# Altium schematic sheet Sensing - Temperature.SchDoc: [13] Sensing - Temperature
size A4; ApprovedBy: Nagy Richard; CheckedBy: Nagy Richard; Author: Nagy Richard; CompanyName: EmbedCore; DrawnBy: Nagy Richard; Engineer: Nagy Richard; Organization: EmbedCore; DocumentNumber: 13; Revision: 1.0; SheetNumber: 13; SheetTotal: 25
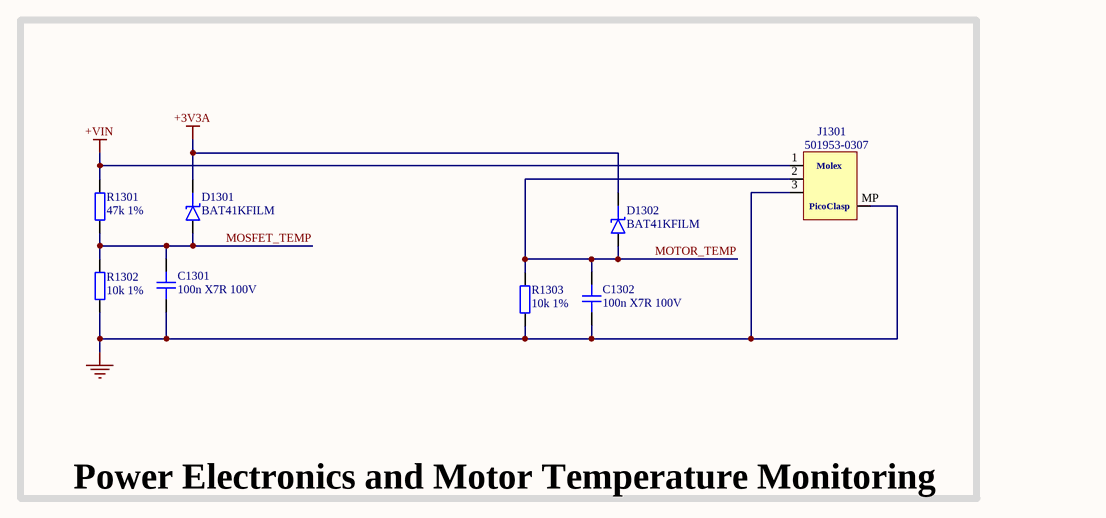
[diagram p0: Sensing - Temperature.SchDoc]

## Parts
C1301  100n X7R 100V  [CAP_0603]
C1302  100n X7R 100V  [CAP_0603]
D1301  BAT41KFILM  [SOD-523]
D1302  BAT41KFILM  [SOD-523]
J1301  501953-0307  [5019530307]
R1301  47k 1%  [RES_0603]
R1302  10k 1%  [RES_0603]
R1303  10k 1%  [RES_0603]

## Blocks framed on the sheet
Power Electronics and Motor Temperature Monitoring: C1301 C1302 D1301 D1302 J1301 R1301-R1303

## Nets
+3V3A: D1301.K D1302.K
+VIN: J1301.1 R1301.2
GND: C1301.1 C1302.1 J1301.3 J1301.MP R1302.1 R1303.1
MOSFET_TEMP: C1301.2 D1301.A R1301.1 R1302.2
MOTOR_TEMP: C1302.2 D1302.A J1301.2 R1303.2

## Notes on the sheet
- Title:
- Drawn By:
- Page Contents:
- Checked By:
- Size:
- Date:
- File:
- License:
- Email:
- A4
- Number:
- Time:
- Revision:
- Sheet
- Website:
- of
- (in symbol 501953-0307) Molex; PicoClasp

## Library data of the parts
C1301 C1302 = CAP_0603: Capacitor SMD 0603; Manufacturer: CCTC; Manufacturer Part Number: TCC0603X7R104K101CT; Distributor Link: www.lcsc.com; LCSC: C696916; Rating: *; Dielectric: *
D1301 D1302 = D_SCHOTTKY_SOD_523: Diode Schottky SMD SOD-323; Manufacturer: STMicroelectronics; Manufacturer Part Number: BAT41KFILM; LCSC: C73150
J1301 = 501953-0307: Headers & Wire Housings 1.0WtBWaferAssyR/A1- -Row3Ckt+LKEmbsTpPkg
R1301 = RES_0603: Resistor SMD 0603; Manufacturer: Vishay Intertech; Manufacturer Part Number: NTCS0603E3473FHT; Distributor Link: www.lcsc.com; LCSC: C511055
R1302 R1303 = RES_0603: Resistor SMD 0603; Manufacturer: YAGEO; Manufacturer Part Number: RC0603FR-07140KL; Distributor Link: www.lcsc.com; LCSC: C185372